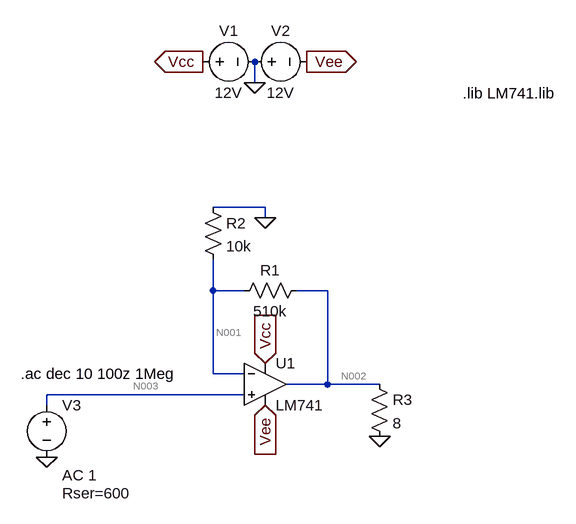
[diagram p0: schematic non_inverting_closed_loop.asc]
non_inverting_closed_loop.asc, the LTspice schematic file:
Version 4.1
SHEET 1 880 680
WIRE 192 -304 192 -336
WIRE 208 -112 128 -112
WIRE 208 -96 208 -112
WIRE 128 16 128 -32
WIRE 176 16 128 16
WIRE 304 16 256 16
WIRE 128 144 128 16
WIRE 176 144 128 144
WIRE 304 160 304 16
WIRE 304 160 240 160
WIRE 384 160 304 160
WIRE 176 176 -128 176
WIRE -128 192 -128 176
FLAG 192 -304 0
FLAG 112 -336 Vcc
IOPIN 112 -336 Out
FLAG 272 -336 Vee
IOPIN 272 -336 Out
FLAG 208 128 Vcc
IOPIN 208 128 In
FLAG 208 192 Vee
IOPIN 208 192 In
FLAG -128 272 0
FLAG 384 240 0
FLAG 208 -96 0
DATAFLAG 304 48 ""
SYMBOL voltage 96 -336 R270
WINDOW 0 32 56 VTop 2
WINDOW 3 -32 56 VBottom 2
WINDOW 123 0 0 Left 0
WINDOW 39 0 0 Left 0
SYMATTR InstName V1
SYMATTR Value 12V
SYMBOL voltage 176 -336 R270
WINDOW 0 32 56 VTop 2
WINDOW 3 -32 56 VBottom 2
WINDOW 123 0 0 Left 0
WINDOW 39 0 0 Left 0
SYMATTR InstName V2
SYMATTR Value 12V
SYMBOL res 272 0 R90
WINDOW 0 0 56 VBottom 2
WINDOW 3 32 56 VTop 2
SYMATTR InstName R1
SYMATTR Value 510k
SYMBOL res 112 -128 R0
SYMATTR InstName R2
SYMATTR Value 10k
SYMBOL voltage -128 176 R0
WINDOW 123 24 124 Left 2
WINDOW 39 24 152 Left 2
SYMATTR Value2 AC 1
SYMATTR SpiceLine Rser=600
SYMATTR InstName V3
SYMATTR Value ""
SYMBOL LM741 208 96 R0
SYMATTR InstName U1
SYMBOL res 368 144 R0
SYMATTR InstName R3
SYMATTR Value 8
TEXT 512 -288 Left 2 !.lib LM741.lib
TEXT -168 144 Left 2 !.ac dec 10 100z 1Meg

The netlist it stands for:
* non_inverting_closed_loop.asc
V1 Vcc 0 12V
V2 0 Vee 12V
R1 N002 N001 510k
R2 0 N001 10k
V3 N003 0 AC 1 Rser=600
X§U1 N003 N001 Vcc Vee N002 LM741  ; pins In+ In- V+ V- OUT
R3 N002 0 8
.lib LM741.lib
.ac dec 10 100z 1Meg
.lib LM741.lib
.backanno
.end

* Results of the author's LTspice run, read from the files saved beside the schematic
* Operating Point, zero values left out:
*   V(vee) = -12 V
*   V(n001) = 962.5 µV
*   V(n003) = -34.72 µV
*   V(vcc) = 12 V
*   V(n002) = 102 mV
*   I(V1) = -14.3 mA
*   I(R3) = 12.75 mA
*   I(R1) = 198.1 nA
*   I(V3) = -57.87 nA
*   I(R2) = -96.25 nA
*   I(V2) = -1.55 mA
*   Ix(u1:1) = 57.87 nA
*   Ix(u1:2) = 101.9 nA
*   Ix(u1:99) = 14.3 mA
*   Ix(u1:50) = -1.55 mA
*   Ix(u1:28) = -12.75 mA
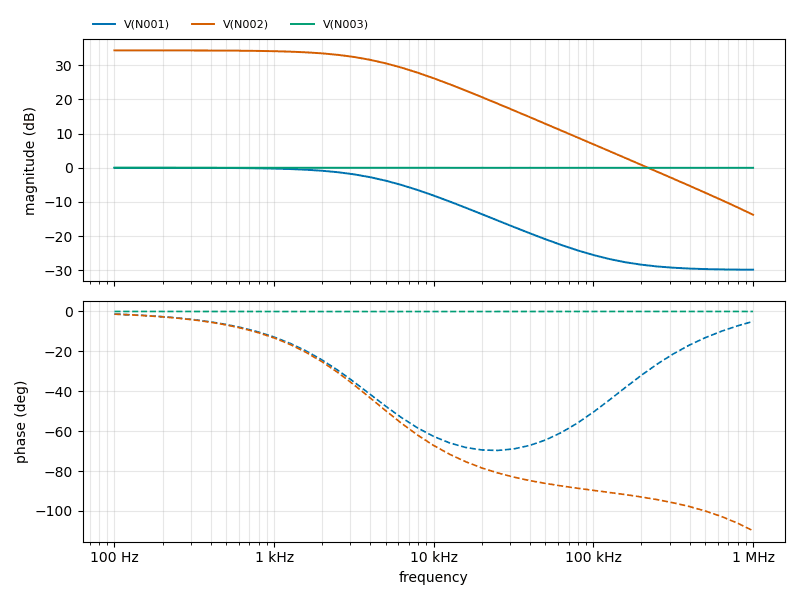
[diagram p1: AC Analysis of non_inverting_closed_loop.asc, plotted from the saved traces]
* AC Analysis, 1 run:
*   V(N001): -0.01 dB at 100 Hz, -29.80 dB at 1 MHz, peak -0.01 dB at 100 Hz, 3 dB below the peak at 4.232 kHz
*   V(N002): 34.31 dB at 100 Hz, -13.74 dB at 1 MHz, peak 34.31 dB at 100 Hz, 3 dB below the peak at 4.228 kHz
*   V(N003): -0.00 dB at 100 Hz, -0.02 dB at 1 MHz, peak -0.00 dB at 100 Hz